# Altium schematic sheet Microcontroller.SchDoc
size A4; SheetNumber: 2; SheetTotal: 3
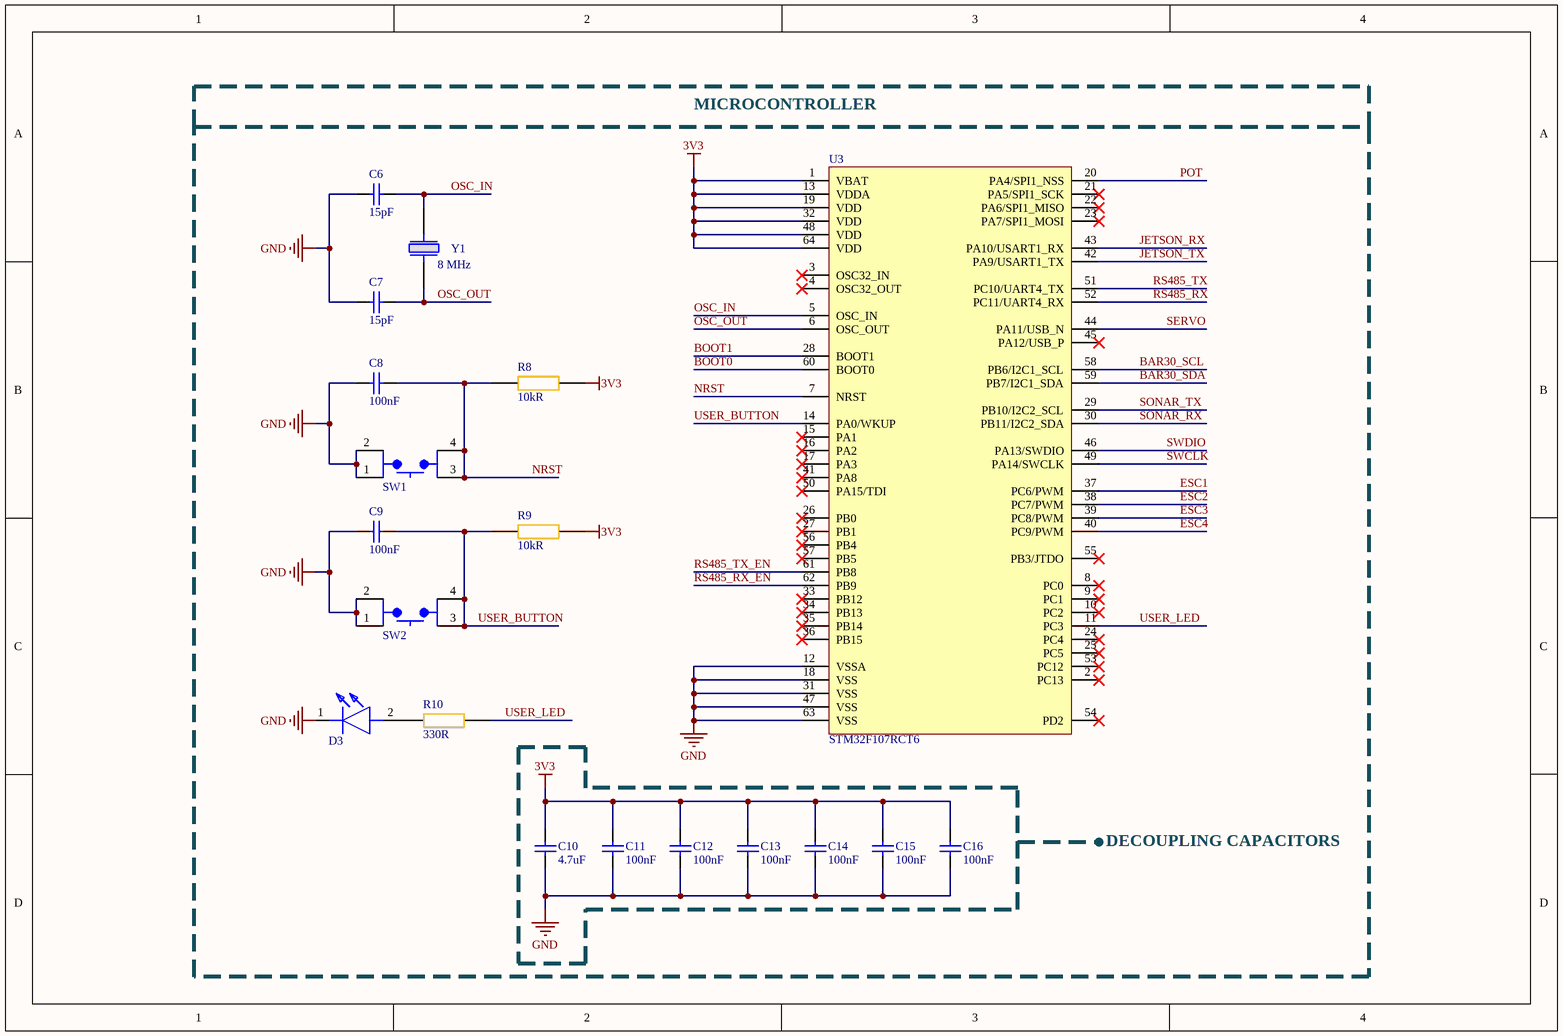
[diagram p0: Microcontroller.SchDoc]

## Parts
C6  15pF  [WCAP-CSGP_0603_L1.6W0.8H0.8_Reflow]
C7  15pF  [WCAP-CSGP_0603_L1.6W0.8H0.8_Reflow]
C8  100nF  [WCAP-CSGP_0603_L1.6W0.8H0.8_Reflow]
C9  100nF  [WCAP-CSGP_0603_L1.6W0.8H0.8_Reflow]
C10  4.7uF  [WCAP-CSGP_0805_L2W1.25H1.25]
C11  100nF  [WCAP-CSGP_0603_L1.6W0.8H0.8_Reflow]
C12  100nF  [WCAP-CSGP_0603_L1.6W0.8H0.8_Reflow]
C13  100nF  [WCAP-CSGP_0603_L1.6W0.8H0.8_Reflow]
C14  100nF  [WCAP-CSGP_0603_L1.6W0.8H0.8_Reflow]
C15  100nF  [WCAP-CSGP_0603_L1.6W0.8H0.8_Reflow]
C16  100nF  [WCAP-CSGP_0603_L1.6W0.8H0.8_Reflow]
D3  APT1608SGC  [LED GREEN]  (value not drawn)
R8  Resistance: 10kR  [RES 0603]  (hidden comment: RC0603FR-0710KP)
R9  Resistance: 10kR  [RES 0603]  (hidden comment: RC0603FR-0710KP)
R10  Resistance: 330R  [RES 0603]  (hidden comment: RC0603FR-07330RL)
SW1  TL3305AF260QG  [RESET BUTTON]  (value not drawn)
SW2  TL3305AF260QG  [RESET BUTTON]  (value not drawn)
U3  STM32F107RCT6  [STM32F107RCT6]
Y1  Frequency: 8 MHz  [OSC]  (hidden comment: ECS-80-20-5PXDU-TR)

## Nets
3V3: C10.2 C11.2 C12.2 C13.2 C14.2 C15.2 C16.2 R8.1 R9.1 U3.1(VBAT) U3.13(VDDA) U3.19(VDD) U3.32(VDD) U3.48(VDD) U3.64(VDD)
GND: C6.1 C7.1 C8.2 C9.2 C10.1 C11.1 C12.1 C13.1 C14.1 C15.1 C16.1 D3.1(K) SW1.1 SW1.2 SW2.1 SW2.2 U3.12(VSSA) U3.18(VSS) U3.31(VSS) U3.47(VSS) U3.63(VSS)
BAR30_SCL: U3.58(PB6/I2C1_SCL)
BAR30_SDA: U3.59(PB7/I2C1_SDA)
BOOT0: U3.60(BOOT0)
BOOT1: U3.28(BOOT1)
ESC1: U3.37(PC6/PWM)
ESC2: U3.38(PC7/PWM)
ESC3: U3.39(PC8/PWM)
ESC4: U3.40(PC9/PWM)
JETSON_RX: U3.43(PA10/USART1_RX)
JETSON_TX: U3.42(PA9/USART1_TX)
NRST: C8.1 R8.2 SW1.3 SW1.4 U3.7(NRST)
OSC_IN: C6.2 U3.5(OSC_IN) Y1.1
OSC_OUT: C7.2 U3.6(OSC_OUT) Y1.2
POT: U3.20(PA4/SPI1_NSS)
RS485_RX: U3.52(PC11/UART4_RX)
RS485_RX_EN: U3.62(PB9)
RS485_TX: U3.51(PC10/UART4_TX)
RS485_TX_EN: U3.61(PB8)
SERVO: U3.44(PA11/USB_N)
SONAR_RX: U3.30(PB11/I2C2_SDA)
SONAR_TX: U3.29(PB10/I2C2_SCL)
SWCLK: U3.49(PA14/SWCLK)
SWDIO: U3.46(PA13/SWDIO)
USER_BUTTON: C9.1 R9.2 SW2.3 SW2.4 U3.14(PA0/WKUP)
USER_LED: R10.2 U3.11(PC3)
NetD3_2: D3.2(A) R10.1

Not connected (* = marked no-connect by the designer): U3 2(PC13)* 3(OSC32_IN)* 4(OSC32_OUT)* 8(PC0)* 9(PC1)* 10(PC2)* 15(PA1)* 16(PA2)* 17(PA3)* 21(PA5/SPI1_SCK)* 22(PA6/SPI1_MISO)* 23(PA7/SPI1_MOSI)* 24(PC4)* 25(PC5)* 26(PB0)* 27(PB1)* 33(PB12)* 34(PB13)* 35(PB14)* 36(PB15)* 41(PA8)* 45(PA12/USB_P)* 50(PA15/TDI)* 53(PC12)* 54(PD2)* 55(PB3/JTDO)* 56(PB4)* 57(PB5)*

## Notes on the sheet
- MICROCONTROLLER
- DECOUPLING CAPACITORS

## Library data of the parts
C6 C7 = 885012006018: WCAP-CSGP Multilayer Ceramic Chip Capacitor, General Purpose, size 0603, NP0, 15pF, 16VDC; Manufacturer: Wurth Elektronik; Case/Size Code: 0603; Capacitance Tolerance: +/-5%; Insulation Resistance: 10GOhm; Q Factor: 700; Rated Voltage (DC): 16V; Technical Reference: NP00603150J016DFCT10000; Manufacturer Part Number: 885012006018; Category: Multilayer Ceramic Chip Capacitors; Match Code: WCAP-CSGP; ComponentLink1Description: Website Link; ComponentLink1URL: https://www.we-online.com/redexpert/article/885012006018?ad; ComponentLink2Description: Datasheet Link; ComponentLink2URL: https://www.we-online.com/redexpert/spec/885012006018?ad; Mount: Surface Mount; Operating Temperature Max: 125°C; Operating Temperature Min: -55°C; Packaging: Tape and Reel; Length: 1.6mm; Width: 0.8mm; Height: 0.8mm; Capacitance: 15pF; Ceramic Type: NP0
C8 C9 = 885012206020: WCAP-CSGP Multilayer Ceramic Chip Capacitor, General Purpose, size 0603, X7R, 100nF, 10VDC; Manufacturer: Wurth Elektronik; Case/Size Code: 0603; Capacitance Tolerance: +/-10%; Dissipation Factor: 5%; Insulation Resistance: 5GOhm; Rated Voltage (DC): 10V; Technical Reference: X7R0603104K010DFCT10000; Manufacturer Part Number: 885012206020; Category: Multilayer Ceramic Chip Capacitors; Match Code: WCAP-CSGP; ComponentLink1Description: Website Link; ComponentLink1URL: https://www.we-online.com/redexpert/article/885012206020?ad; ComponentLink2Description: Datasheet Link; ComponentLink2URL: https://www.we-online.com/redexpert/spec/885012206020?ad; Mount: Surface Mount; Operating Temperature Max: 125°C; Operating Temperature Min: -55°C; Packaging: Tape and Reel; Length: 1.6mm; Width: 0.8mm; Height: 0.8mm; Capacitance: 100nF; Ceramic Type: X7R
C10 = 885012207053: WCAP-CSGP Multilayer Ceramic Chip Capacitor, General Purpose, size 0805, X7R, 4.7µF, 16VDC; Manufacturer: Wurth Elektronik; Case/Size Code: 0805; Capacitance Tolerance: +/-10%; Dissipation Factor: 10%; Insulation Resistance: 0.02GOhm; Rated Voltage (DC): 16V; Technical Reference: X7R0805475K016DFCT10000; Manufacturer Part Number: 885012207053; Category: Multilayer Ceramic Chip Capacitors; Match Code: WCAP-CSGP; ComponentLink1Description: Website Link; ComponentLink1URL: https://www.we-online.com/redexpert/article/885012207053?ad; ComponentLink2Description: Datasheet Link; ComponentLink2URL: https://www.we-online.com/redexpert/spec/885012207053?ad; Mount: Surface Mount; Operating Temperature Max: 125°C; Operating Temperature Min: -55°C; Packaging: Tape and Reel; Length: 2mm; Width: 1.25mm; Height: 1.25mm; Capacitance: 4.7uF; Ceramic Type: X7R
C11-C16 = 885012206046: WCAP-CSGP Multilayer Ceramic Chip Capacitor, General Purpose, size 0603, X7R, 100nF, 16VDC; Manufacturer: Wurth Elektronik; Case/Size Code: 0603; Capacitance Tolerance: +/-10%; Dissipation Factor: 3.5%; Insulation Resistance: 5GOhm; Rated Voltage (DC): 16V; Technical Reference: X7R0603104K016DFCT10000; Manufacturer Part Number: 885012206046; Category: Multilayer Ceramic Chip Capacitors; Match Code: WCAP-CSGP; ComponentLink1Description: Website Link; ComponentLink1URL: https://www.we-online.com/redexpert/article/885012206046?ad; ComponentLink2Description: Datasheet Link; ComponentLink2URL: https://www.we-online.com/redexpert/spec/885012206046?ad; Mount: Surface Mount; Operating Temperature Max: 125°C; Operating Temperature Min: -55°C; Packaging: Tape and Reel; Length: 1.6mm; Width: 0.8mm; Height: 0.8mm; Capacitance: 100nF; Ceramic Type: X7R
D3 = APT1608SGC: LED GREEN CLEAR 0603 SMD; Manufacturer: Kingbright; Forward Voltage: 2.2V; Viewing Angle: 120°; Forward Current: 20mA; Luminous Intensity: 15mcd; Lens Style: Clear,Flat; Dominant Wavelength: 568nm; Number of LEDs: 1; Designed by: ADAK; Supplier 1: Digi-Key; Manufacturer Part Number: APT1608SGC; RoHS: Yes; Category: LEDs; Stock 1: 356278; Pricing 1: 1=0,3, 10=0,237, 100=0,1064, 500=0,0961, 1000=0,07894 (USD); Mount: Surface Mount; Case/Package: 0603; Number of Pins: 2; Color: Green; Case Code (Metric): 1608; Case Code (Imperial): 0603; Lens Color: Clear; Min Operating Temperature: -40°C; Max Operating Temperature: 85°C; Package Quantity: 2000; Illumination Color: Green; Packaging: Tape and Reel; Test Current: 20mA; Wavelength: 568nm; Series: APT; Length: 1.6mm; Width: 0.8mm; Height: 0.75mm; Lead Free: Lead Free; RoHS Compliant: Yes; ComponentLink1URL: https://datasheet.ciiva.com/12400/apt1608sgc-32861-12400932.pdf?src-supplier=Mouser; ComponentLink1Description: https://datasheet.ciiva.com/12400/apt1608sgc-32861-12400932.pdf?src-supplier=Mouser; ComponentLink2URL: https://datasheet.ciiva.com/2113/apt1608sgc-2113808.pdf?src-supplier=Digi-Key; ComponentLink2Description: https://datasheet.ciiva.com/2113/apt1608sgc-2113808.pdf?src-supplier=Digi-Key; ComponentLink3URL: https://datasheet.ciiva.com/14603/70062839-14603927.pdf?src-supplier=Allied+Electronics; ComponentLink3Description: https://datasheet.ciiva.com/14603/70062839-14603927.pdf?src-supplier=Allied+Electronics; Supplier Part Number 1: 754-1121-1-ND
R8 R9 = RES 10K OHM 0603: RES 10K OHM 1% 1/10W 0603 SMD; Manufacturer: Yageo; Max Power Dissipation: 100mW; Temperature Coefficient: 150ppm/°C; Designed by: ADAK; Supplier 1: Digi-Key; Manufacturer Part Number: RC0603FR-0710KP; RoHS: Yes; Category: Chip SMD Resistors; Stock 1: 239190; Pricing 1: 1=0,1, 10=0,024, 50=0,0154, 100=0,0129, 500=0,00892, 1000=0,0077 (USD); Case/Package: 0603; Case Code (Metric): 1608; Case Code (Imperial): 0603; Min Operating Temperature: -55°C; Max Operating Temperature: 155°C; Packaging: Cut Tape; Number of Terminations: 2; Tolerance: 1%; Features: Moisture Resistant; Series: RC-P Lead Free; Length: 0.063inch; Width: 0.031inch; Height: 0.022inch; RoHS Compliant: Yes; ComponentLink1URL: https://www.mouser.com/ds/2/447/yageodocoutput-1115409.pdf?src-supplier=Mouser; ComponentLink1Description: https://www.mouser.com/ds/2/447/yageodocoutput-1115409.pdf?src-supplier=Mouser; ComponentLink2URL: http://www.yageo.com/NewPortal/yageodocoutput?fileName=/pdf/R-Chip/PYu-RC_51_RoHS_P_0.pdf&src-supplier=Digi-Key; ComponentLink2Description: http://www.yageo.com/NewPortal/yageodocoutput?fileName=/pdf/R-Chip/PYu-RC_51_RoHS_P_0.pdf&src-supplier=Digi-Key; ComponentLink3URL: http://www.yageo.com.tw/exep/pages/download/literatures/PYu-R_INT-thick_7.pdf?src-supplier=Digi-Key; ComponentLink3Description: http://www.yageo.com.tw/exep/pages/download/literatures/PYu-R_INT-thick_7.pdf?src-supplier=Digi-Key; Supplier Part Number 1: YAG1290CT-ND
R10 = RES 330 OHM 0603: RES 330 OHM 1% 1/10W 0603 SMD; Manufacturer: Yageo; Voltage Rating (DC): 50V; Power Rating: 100mW; Temperature Coefficient: 100ppm/°C; Designed by: ADAK; Supplier 1: Digi-Key; Manufacturer Part Number: RC0603FR-07330RL; RoHS: Yes; Category: Chip SMD Resistors; Stock 1: 1275960; Pricing 1: 1=0,1, 10=0,018, 50=0,0106, 100=0,0088, 500=0,00592, 1000=0,00505 (USD); Case/Package: 0603; Number of Pins: 2; Case Code (Metric): 1608; Case Code (Imperial): 0603; Size Code: 0603; Min Operating Temperature: -55°C; Max Operating Temperature: 155°C; Tolerance: 1%; Resistor Type: Thick Film; Packaging: Tape and Reel; Voltage Rating: 50V; Package Quantity: 1; Number of Terminations: 2; Termination: SMD/SMT; Max Power Dissipation: 100mW; Features: Moisture Resistant; Series: RC; Resistance Tolerance: 1%; Technology: THICK FILM; Length: 1.6mm; Width: 0.8mm; Height: 0.45mm; Depth: 0.8mm; Reach SVHC Compliant: No; Lead Free: Lead Free; RoHS Compliant: Yes; ComponentLink1URL: https://datasheet.ciiva.com/11819/0900766b80f96399-11819327.pdf?src-supplier=Rs; ComponentLink1Description: https://datasheet.ciiva.com/11819/0900766b80f96399-11819327.pdf?src-supplier=Rs; ComponentLink2URL: https://datasheet.ciiva.com/7746/1686128-7746331.pdf?src-supplier=Element14; ComponentLink2Description: https://datasheet.ciiva.com/7746/1686128-7746331.pdf?src-supplier=Element14; ComponentLink3URL: https://datasheet.ciiva.com/46440/1868787-46440904.pdf?src-supplier=Element14; ComponentLink3Description: https://datasheet.ciiva.com/46440/1868787-46440904.pdf?src-supplier=Element14; ComponentLink4URL: https://datasheet.ciiva.com/2454/pyu-r-int-thick-7-2454865.pdf?src-supplier=Digi-Key; ComponentLink4Description: https://datasheet.ciiva.com/2454/pyu-r-int-thick-7-2454865.pdf?src-supplier=Digi-Key; ComponentLink5URL: https://datasheet.ciiva.com/2454/pyu-r-int-thick-7-2454866.pdf?src-supplier=Digi-Key; ComponentLink5Description: https://datasheet.ciiva.com/2454/pyu-r-int-thick-7-2454866.pdf?src-supplier=Digi-Key; ComponentLink6URL: https://datasheet.ciiva.com/2454/pyu-r-int-thick-7-2454864.pdf?src-supplier=Digi-Key; ComponentLink6Description: https://datasheet.ciiva.com/2454/pyu-r-int-thick-7-2454864.pdf?src-supplier=Digi-Key; ComponentLink7URL: https://datasheet.ciiva.com/12555/rc0603-272842-12555334.pdf?src-supplier=Mouser; ComponentLink7Description: https://datasheet.ciiva.com/12555/rc0603-272842-12555334.pdf?src-supplier=Mouser; ComponentLink8URL: https://datasheet.ciiva.com/7746/443971-7746329.pdf?src-supplier=Element14; ComponentLink8Description: https://datasheet.ciiva.com/7746/443971-7746329.pdf?src-supplier=Element14; ComponentLink9URL: https://datasheet.ciiva.com/7746/443971-7746330.pdf?src-supplier=Element14; ComponentLink9Description: https://datasheet.ciiva.com/7746/443971-7746330.pdf?src-supplier=Element14; Supplier Part Number 1: 311-330HRCT-ND
SW1 SW2 = TL3305AF260QG: SWITCH TACTILE SPST-NO 50MA 12V; Manufacturer: E-Switch; Mechanical Life: 200000Cycles; Illumination Type: Non-Illuminated; Operating Force: 260gf; Throw Configuration: SPST; Switch Travel: 0.2mm; Switch Function: Off-Mom; Actuator Type: Standard; Designed by: ADAK; Supplier 1: Digi-Key; Manufacturer Part Number: TL3305AF260QG; RoHS: No; Category: Tactile Switches; Stock 1: 83741; Pricing 1: 1=0,21, 10=0,205, 25=0,1944, 100=0,176, 250=0,16048, 500=0,14918, 1000=0,12726 (USD); Mount: Surface Mount; Min Operating Temperature: -20°C; Max Operating Temperature: 70°C; Packaging: Cut Tape; Termination: Gull Wing; Series: TL3305; Lead Free: Lead Free; ComponentLink1URL: http://www.farnell.com/datasheets/2554191.pdf?src-supplier=Farnell; ComponentLink1Description: http://www.farnell.com/datasheets/2554191.pdf?src-supplier=Farnell; ComponentLink2URL: http://www.farnell.com/datasheets/2554191.pdf?src-supplier=Newark; ComponentLink2Description: http://www.farnell.com/datasheets/2554191.pdf?src-supplier=Newark; ComponentLink3URL: http://spec_sheets.e-switch.com/specs/P010471.pdf?src-supplier=Mouser; ComponentLink3Description: http://spec_sheets.e-switch.com/specs/P010471.pdf?src-supplier=Mouser; ComponentLink4URL: http://www.farnell.com/datasheets/2554191.pdf?src-supplier=Element14; ComponentLink4Description: http://www.farnell.com/datasheets/2554191.pdf?src-supplier=Element14; ComponentLink5URL: http://spec_sheets.e-switch.com/specs/P010471.pdf?src-supplier=Digi-Key; ComponentLink5Description: http://spec_sheets.e-switch.com/specs/P010471.pdf?src-supplier=Digi-Key; ComponentLink6URL: http://spec_sheets.e-switch.com/specs/P010471.pdf?src-supplier=NAC+Semi; ComponentLink6Description: http://spec_sheets.e-switch.com/specs/P010471.pdf?src-supplier=NAC+Semi; Supplier Part Number 1: EG5353CT-ND
U3 = STM32F107RCT6: IC MCU 32BIT 256KB FLASH 64LQFP; Manufacturer: STMicroelectronics; Max Supply Voltage: 3.6V; Frequency: 72MHz; Interface: I2C,SPI,USB,CAN,Ethernet,IrDA,UART,USART,LIN,I2S; RAM Size: 64KB; Max Power Dissipation: 444mW; Number of I/Os: 51; Number of Timers/Counters: 7; Number of PWM Channels: 16; Number of Ethernet Channels: 1; Min Supply Voltage: 2V; Data Bus Width: 32b; Oscillator Type: Internal; Number of SPI Channels: 3; Watchdog Timer: Yes; Peripherals: POR,PWM,WDT,DMA,Voltage Detect,I2C; Core Architecture: ARM; Designed by: ADAK; Supplier 1: Digi-Key; RoHS: Yes; Category: Microcontrollers; Stock 1: 1012; Pricing 1: 1=10,39, 10=9,39, 25=8,9536, 160=7,77419, 320=7,42478, 480=6,76965, 960=6,18045 (USD); Case/Package: LQFP; Number of Pins: 64; Min Operating Temperature: -40°C; Max Operating Temperature: 85°C; Package Quantity: 160; Number of ADC Channels: 16; Density: 256KB; Packaging: Tray; Number of Programmable I/O: 51; Termination: SMD/SMT; Max Frequency: 72MHz; Number of I2C Channels: 1; Memory Type: FLASH; Memory Size: 256KB; Series: STM32 F1; Length: 10mm; Width: 10mm; Height: 1.45mm; Radiation Hardening: No; Reach SVHC Compliant: No; Lead Free: Lead Free; RoHS Compliant: Yes; ComponentLink1URL: https://datasheet.ciiva.com/8054/1455641-8054992.pdf?src-supplier=Element14; ComponentLink1Description: https://datasheet.ciiva.com/8054/1455641-8054992.pdf?src-supplier=Element14; Supplier Part Number 1: 497-8914-ND; Manufacturer Part Number: STM32F107RCT6
Y1 = ECS-80-20-5PXDU-TR: CRYSTAL 8.0000MHZ 20PF SMD; Manufacturer: ECS International; Designed by: ADAK; Supplier 1: Digi-Key; Manufacturer Part Number: ECS-80-20-5PXDU-TR; RoHS: Yes; Category: Crystals; Stock 1: 109954; Pricing 1: 1=0,48, 10=0,402, 50=0,362, 100=0,3218, 500=0,30572 (USD); ComponentLink1URL: https://datasheet.ciiva.com/852/csm-7x-du-852880.pdf?src-supplier=Digi-Key; ComponentLink1Description: https://datasheet.ciiva.com/852/csm-7x-du-852880.pdf?src-supplier=Digi-Key; ComponentLink2URL: https://datasheet.ciiva.com/852/csm-7x-du-852879.pdf?src-supplier=Digi-Key; ComponentLink2Description: https://datasheet.ciiva.com/852/csm-7x-du-852879.pdf?src-supplier=Digi-Key; ComponentLink3URL: https://datasheet.ciiva.com/852/csm-7x-du-852881.pdf?src-supplier=Digi-Key; ComponentLink3Description: https://datasheet.ciiva.com/852/csm-7x-du-852881.pdf?src-supplier=Digi-Key; ComponentLink4URL: https://datasheet.ciiva.com/4946/csm-7x-du-4946102.pdf?src-supplier=Mouser; ComponentLink4Description: https://datasheet.ciiva.com/4946/csm-7x-du-4946102.pdf?src-supplier=Mouser; Supplier Part Number 1: XC1526CT-ND